# Altium schematic sheet USB_C_Connectors.SchDoc
size A; SheetNumber: 2; SheetTotal: 8
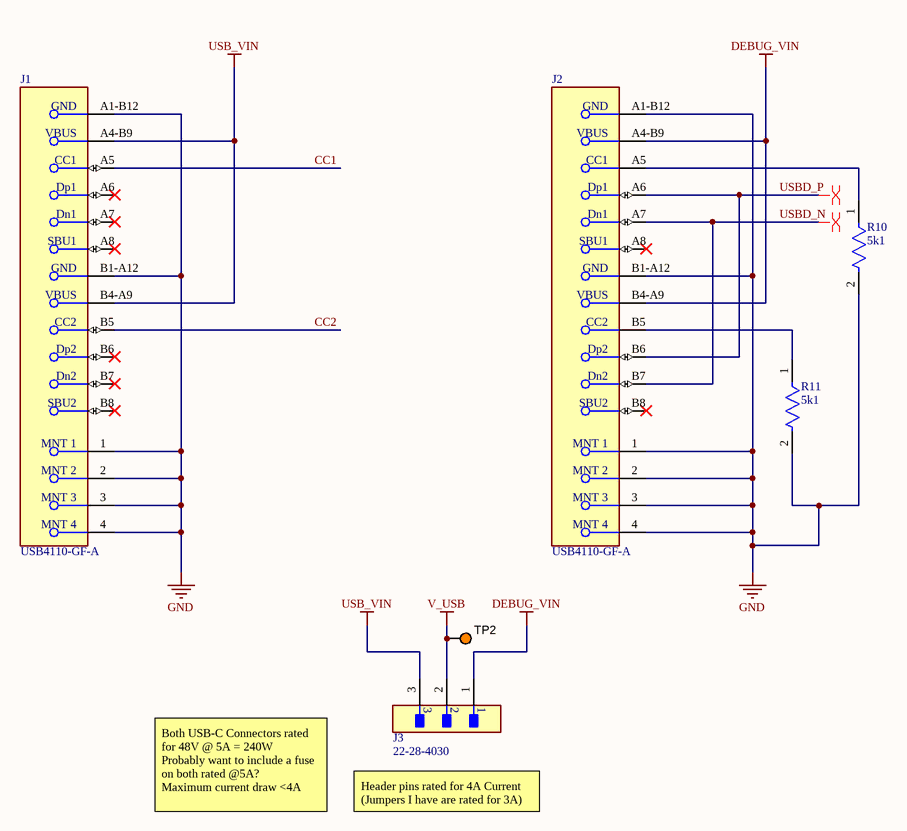
[diagram p0: USB_C_Connectors.SchDoc]

## Parts
J1  USB4110-GF-A  [FP-USB4110-GF-A-MFG]
J2  USB4110-GF-A  [FP-USB4110-GF-A-MFG]
J3  22-28-4030  [FP-22-28-4030-MFG]
R10  5k1  [FP-CRCW0603-C-MFG]
R11  5k1  [FP-CRCW0603-C-MFG]
TP2  5003  [KSTN-5003]  (value not drawn)

## Nets
DEBUG_VIN: J2.A4-B9(VBUS) J2.B4-A9(VBUS) J3.1
GND: J1.1(MNT_1) J1.2(MNT_2) J1.3(MNT_3) J1.4(MNT_4) J1.A1-B12(GND) J1.B1-A12(GND) J2.1(MNT_1) J2.2(MNT_2) J2.3(MNT_3) J2.4(MNT_4) J2.A1-B12(GND) J2.B1-A12(GND) R10.2 R11.2
USB_VIN: J1.A4-B9(VBUS) J1.B4-A9(VBUS) J3.3
V_USB: J3.2 TP2.1
CC1: J1.A5(CC1)
CC2: J1.B5(CC2)
USBD_N: J2.A7(Dn1) J2.B7(Dn2)
USBD_P: J2.A6(Dp1) J2.B6(Dp2)
NetJ2_A5: J2.A5(CC1) R10.1
NetJ2_B5: J2.B5(CC2) R11.1

Not connected (* = marked no-connect by the designer): J1 A6(Dp1)* A7(Dn1)* A8(SBU1)* B6(Dp2)* B7(Dn2)* B8(SBU2)*; J2 A8(SBU1)* B8(SBU2)*

## Layout directives
differential pair: USBD_N, USBD_P

## Notes on the sheet
- Both USB-C Connectors rated for 48V @ 5A = 240W
  Probably want to include a fuse on both rated @5A?
  Maximum current draw <4A
- Header pins rated for 4A Current
  (Jumpers I have are rated for 3A)

## Library data of the parts
J1 J2 = CMP-245163-000002-1: CONN USB 2.0 TYPE-C R/A SMT; Manufacturer: GCT; Conn Orientation: Right Angle; Usb Standard: USB 2.0; Voltage Rating: 20V; Current Rating: 3/4.25/1.25/0.25A; Number Of Contacts: 16; Is Female: yes; Shielding: true; Standoff Height: 0.1mm; Octopart: https://octopart.com/usb4110-gf-a-gct-103941985; Temperature: -40°C to +85°C; RoHS: TRUE; Automotive: No; Contact Material: Gold,Nickel; Device Class L1: Connectors; Device Class L2: USB Connectors; Package: 0; Lead Free: Yes; ComponentLink2URL: https://gct.co/files/drawings/usb4110.pdf; Temperature Range High: +85°C; Temperature Range Low: -40°C; Height: 3.46mm; Manufacturer Part Number: USB4110-GF-A; ComponentLink2Description: Datasheet; Device Class L3: unset; Digikey Description: CONN USB 2.0 TYPE-C R/A SMT; Category: Conn
J3 = CMP-04776-000098-1: CONN HEADER VERT 3POS 2.54MM; Manufacturer: Molex; Conn Orientation: Vertical; Conn Gender: Male; Current Rating: 4A; Voltage Rating: 500V; Number Of Contacts: 3; Category: Conn; Number Of Rows: 1; Manufacturer Part Number: 22-28-4030; RoHS: TRUE; Package: 22-28-4030; Footprint Url: https://www.molex.com/pdm_docs/sd/022284030_sd.pdf; ComponentLink2Description: Datasheet; Device Class L2: Headers and Wire Housings; Automotive: No; Temperature Range Low: -40°C; Digikey Description: CONN HEADER VERT 3POS 2.54MM; Mouser Description: Headers & Wire Housings 3P VERT HEADER Sn; Contact Material: Gold,Nickel; Pitch: 2.54mm; Device Class L1: Connectors; Lead Free: Yes; Device Class L3: unset; Temperature Range High: +80°C; Octopart: https://octopart.com/0022284030-molex-10476094; ComponentLink2URL: https://www.molex.com/webdocs/datasheets/pdf/en-us/0022284030_PCB_HEADERS.pdf; Height: 8.88mm; Temperature: -40°C to +80°C
R10 R11 = CMP-02407-012453-1: RES 5.1K OHM 5% 1/10W 0603; Power Rating: 100mW; Resistance: 5.1kR; Temperature Coefficient: 200ppm/°C; Contact Plating: Tin; Resistor Type: Thick Film; RoHS Compliant: Yes; Mount: Surface Mount; Tolerance: 5%; Lead Free: Lead Free; Min Operating Temperature: -55°C; Max Operating Temperature: 155°C; Termination: Wraparound; Length: 1.55mm; Case/Package: SMD/SMT
TP2 = CMP-1672-00009-1: Test Point, Orange, 1-Pin THD, RoHS; Peak Reverse Current: 600 uA; Forward Current: 3 A; Max Surge Current: 80 A; Forward Voltage: 1.08 V; Max Operating Temperature: 150 degC; PackageReference: 5003; Pins: 2; ComponentLink2URL: http://keyelco.com/userAssets/file/M65p56.pdf; PackageDescription: 1-Pin Through Hole Device, Dia 2.54 mm; Weight: 0.01 lb; Diameter: 5.3 mm; Mount: Through Hole; Package Quantity: 500; Packaging: Bulk; Min Operating Temperature: -65 degC; ComponentLink1Description: Manufacturer URL; Height: 0.25 inch; ComponentLink1URL: http://www.keyelco.com/; ComponentLink2Description: Datasheet; Width: 0.25 inch; REACH SVHC: No SVHC; RoHSCompliant: true; Radiation Hardening: No; Length: 9.5 mm; DatasheetVersion: Jun-15